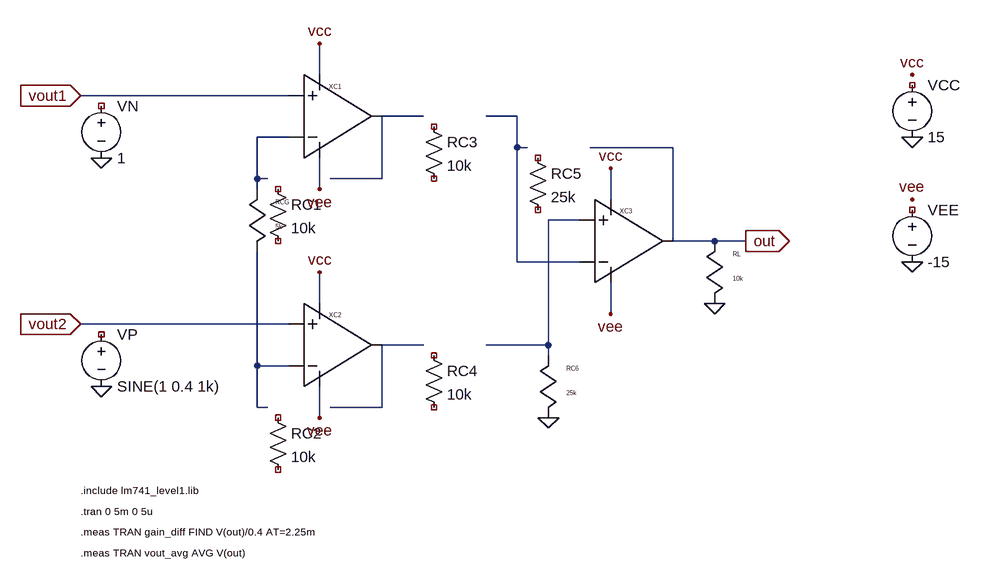
[diagram p0: schematic rs2_bloco_c.asc]
rs2_bloco_c.asc, the LTspice schematic file:
Version 4
SHEET 1 1605 997
WIRE 432 96 432 48
WIRE 432 224 432 272
WIRE 432 448 432 400
WIRE 432 576 432 624
WIRE 880 288 880 240
WIRE 880 416 880 464
WIRE 224 128 384 128
WIRE 224 480 384 480
WIRE 336 192 384 192
WIRE 336 192 336 272
WIRE 336 256 352 256
WIRE 448 256 528 256
WIRE 528 256 528 160
WIRE 336 368 336 608
WIRE 336 544 384 544
WIRE 336 608 352 608
WIRE 448 608 528 608
WIRE 528 608 528 512
WIRE 528 160 592 160
WIRE 688 160 736 160
WIRE 736 160 736 384
WIRE 736 384 832 384
WIRE 528 512 592 512
WIRE 688 512 784 512
WIRE 784 512 784 320
WIRE 784 320 832 320
WIRE 736 208 752 208
WIRE 848 208 976 208
WIRE 976 208 976 352
WIRE 784 512 784 528
WIRE 64 128 224 128
WIRE 64 480 224 480
WIRE 976 352 1088 352
SYMBOL opamp2 384 96 R0
SYMATTR InstName XC1
SYMATTR Value LM741_LEVEL1
SYMBOL opamp2 384 448 R0
SYMATTR InstName XC2
SYMATTR Value LM741_LEVEL1
SYMBOL opamp2 832 288 R0
SYMATTR InstName XC3
SYMATTR Value LM741_LEVEL1
SYMBOL res 352 256 R0
SYMATTR InstName RC1
SYMATTR Value 10k
SYMBOL res_v 336 272 R0
SYMATTR InstName RCG
SYMATTR Value 5k
SYMBOL res 352 608 R0
SYMATTR InstName RC2
SYMATTR Value 10k
SYMBOL res 592 160 R0
SYMATTR InstName RC3
SYMATTR Value 10k
SYMBOL res 592 512 R0
SYMATTR InstName RC4
SYMATTR Value 10k
SYMBOL res 752 208 R0
SYMATTR InstName RC5
SYMATTR Value 25k
SYMBOL res_v 784 528 R0
SYMATTR InstName RC6
SYMATTR Value 25k
SYMBOL voltage 96 128 R0
SYMATTR InstName VN
SYMATTR Value 1
SYMBOL voltage 96 480 R0
SYMATTR InstName VP
SYMATTR Value SINE(1 0.4 1k)
SYMBOL res_v 1040 352 R0
SYMATTR InstName RL
SYMATTR Value 10k
SYMBOL voltage 1344 96 R0
SYMATTR InstName VCC
SYMATTR Value 15
SYMBOL voltage 1344 288 R0
SYMATTR InstName VEE
SYMATTR Value -15
FLAG 432 48 vcc
FLAG 432 272 vee
FLAG 432 400 vcc
FLAG 432 624 vee
FLAG 880 240 vcc
FLAG 880 464 vee
FLAG 784 624 0
FLAG 96 224 0
FLAG 64 128 vout1
IOPIN 64 128 In
FLAG 96 576 0
FLAG 64 480 vout2
IOPIN 64 480 In
FLAG 1040 448 0
FLAG 1088 352 out
IOPIN 1088 352 Out
FLAG 1344 96 vcc
FLAG 1344 192 0
FLAG 1344 288 vee
FLAG 1344 384 0
TEXT 64 736 Left 1 !.include lm741_level1.lib
TEXT 64 768 Left 1 !.tran 0 5m 0 5u
TEXT 64 800 Left 1 !.meas TRAN gain_diff FIND V(out)/0.4 AT=2.25m
TEXT 64 832 Left 1 !.meas TRAN vout_avg AVG V(out)

The netlist it stands for:
* rs2_bloco_c.asc
XXC1 CLAW_IDEAL_OPAMP LM741_LEVEL1
XXC2 CLAW_IDEAL_OPAMP LM741_LEVEL1
XXC3 CLAW_IDEAL_OPAMP LM741_LEVEL1
RC1 NC_01 NC_02 10k
RCG N001 N003 5k
RC2 NC_03 NC_04 10k
RC3 NC_05 NC_06 10k
RC4 NC_07 NC_08 10k
RC5 NC_09 NC_10 25k
RC6 N006 0 25k
VN NC_11 0 1
VP NC_12 0 SINE(1 0.4 1k)
RL out 0 10k
VCC NC_13 0 15
VEE NC_14 0 -15
.include lm741_level1.lib
.tran 0 5m 0 5u
.meas TRAN gain_diff FIND V(out)/0.4 AT=2.25m
.meas TRAN vout_avg AVG V(out)
.backanno
.end